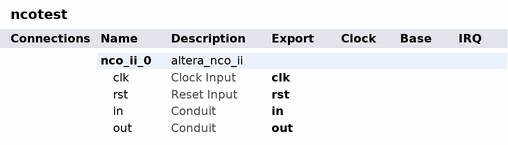
[diagram p0: system contents]
# Platform Designer (Qsys) system ncotest, Cyclone IV E EP4CE22F17C6
# Parameters at their usual value, and those the tool derives, are not listed.
package require -exact qsys 23.1
create_system ncotest
set_project_property DEVICE_FAMILY {Cyclone IV E}
set_project_property DEVICE EP4CE22F17C6

add_instance nco_ii_0 altera_nco_ii 23.1
set_instance_property nco_ii_0 AUTO_EXPORT true
set_instance_parameter_value nco_ii_0 apr 32
set_instance_parameter_value nco_ii_0 apri 16
set_instance_parameter_value nco_ii_0 arch cordic
set_instance_parameter_value nco_ii_0 freq_out 0.007
set_instance_parameter_value nco_ii_0 fsamp 0.8
set_instance_parameter_value nco_ii_0 mpr 12
set_instance_parameter_value nco_ii_0 selected_device_family {Cyclone IV E}
set_instance_parameter_value nco_ii_0 want_sin_and_cos dual_output

# exported interfaces
add_interface clk clock sink
set_interface_property clk EXPORT_OF nco_ii_0.clk
add_interface in conduit end
set_interface_property in EXPORT_OF nco_ii_0.in
add_interface out conduit end
set_interface_property out EXPORT_OF nco_ii_0.out
add_interface rst reset sink
set_interface_property rst EXPORT_OF nco_ii_0.rst

set_interconnect_requirement {$system} qsys_mm.clockCrossingAdapter HANDSHAKE
set_interconnect_requirement {$system} qsys_mm.enableEccProtection FALSE
set_interconnect_requirement {$system} qsys_mm.insertDefaultSlave FALSE
set_interconnect_requirement {$system} qsys_mm.maxAdditionalLatency 1

save_system ncotest.qsys
